# Altium schematic sheet CPU.SchDoc
size A3
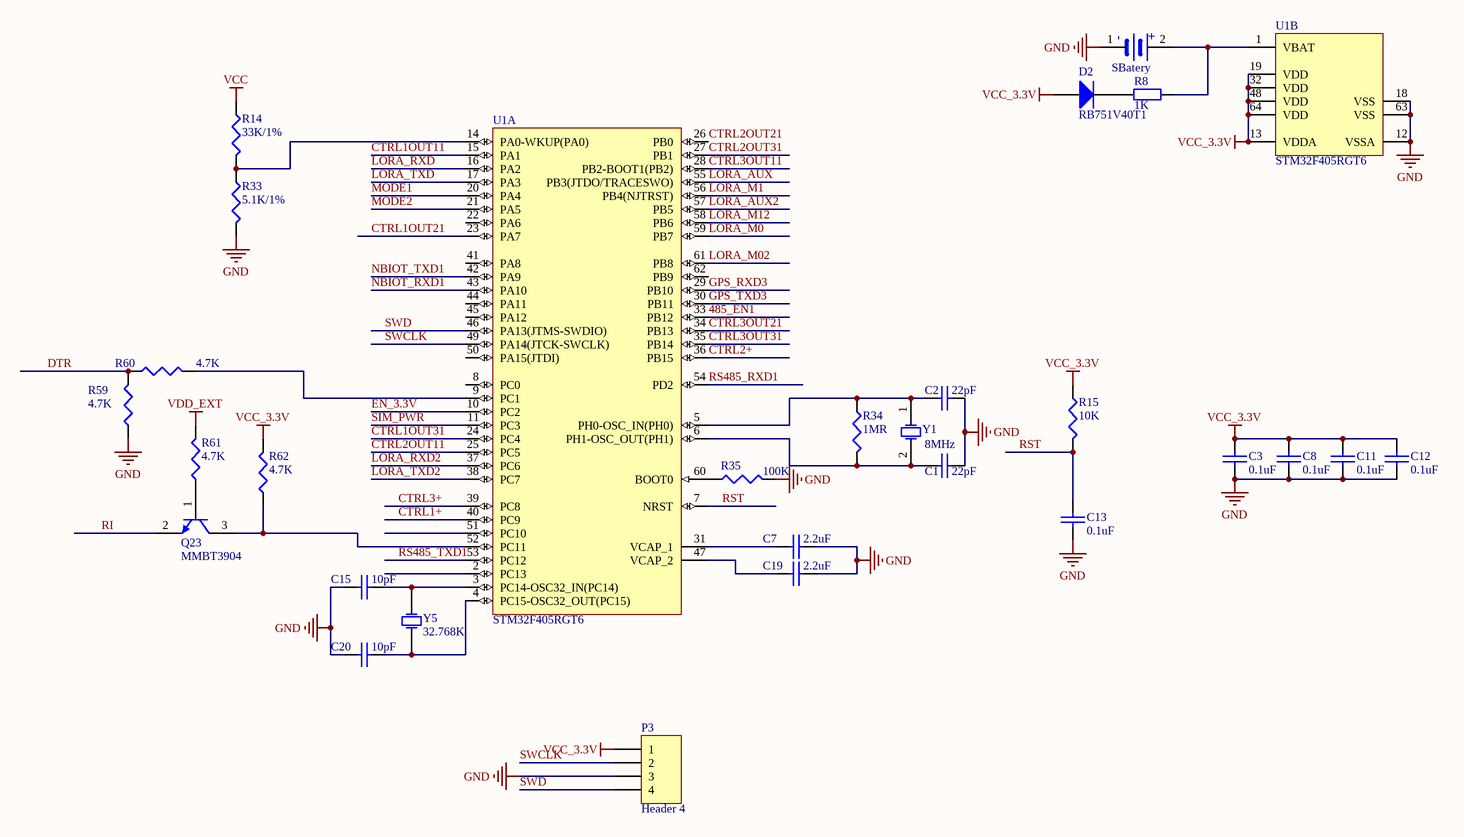
[diagram p0: CPU.SchDoc]

## Parts
C1  22pF  [0603c]
C2  22pF  [0603c]
C3  0.1uF  [0603c]
C7  2.2uF  [0603c]
C8  0.1uF  [0603c]
C11  0.1uF  [0603c]
C12  0.1uF  [0603c]
C13  0.1uF  [0603c]
C15  10pF  [0603c]
C19  2.2uF  [0603c]
C20  10pF  [0603c]
D2  RB751V40T1  [SOD323]
P3  Header 4  [HDR1X4]
Q23  MMBT3904  [SOT23-3]
R8  1K  [0603R]
R14  33K/1%  [0603R]
R15  10K  [0603R]
R33  5.1K/1%  [0603R]
R34  1MR  [0603R]
R35  100K  [0603R]
R59  4.7K  [0603R]
R60  4.7K  [0603R]
R61  4.7K  [0603R]
R62  4.7K  [0603R]
SBatery  SBatery  [MS621FE]  (value not drawn)
U1  STM32F405RGT6  [LQFP-64]  (parts A,B of 2)
Y1  8MHz  [CRAY_5032]
Y5  32.768K  [32.768K]

## Nets
GND: C1.1 C2.1 C3.1 C7.1 C8.1 C11.1 C12.1 C13.1 C15.1 C19.1 C20.1 P3.3 R33.2 R35.2 R59.1 SBatery.1 U1.12(VSSA) U1.18(VSS) U1.63(VSS)
VCC: R14.1
VCC_3.3V: C3.2 C8.2 C11.2 C12.2 D2.1(A) P3.1 R15.1 R62.2 U1.13(VDDA) U1.19(VDD) U1.32(VDD) U1.48(VDD) U1.64(VDD)
VDD_EXT: R61.2
485_EN1: U1.33(PB12)
CTRL1+: U1.40(PC9)
CTRL1OUT11: U1.15(PA1)
CTRL1OUT21: U1.23(PA7)
CTRL1OUT31: U1.24(PC4)
CTRL2+: U1.36(PB15)
CTRL2OUT11: U1.25(PC5)
CTRL2OUT21: U1.26(PB0)
CTRL2OUT31: U1.27(PB1)
CTRL3+: U1.39(PC8)
CTRL3OUT11: U1.28(PB2-BOOT1(PB2))
CTRL3OUT21: U1.34(PB13)
CTRL3OUT31: U1.35(PB14)
DTR: R59.2 R60.1
EN_3.3V: U1.10(PC2)
GPS_RXD3: U1.29(PB10)
GPS_TXD3: U1.30(PB11)
LORA_AUX: U1.55(PB3(JTDO/TRACESWO))
LORA_AUX2: U1.57(PB5)
LORA_M0: U1.59(PB7)
LORA_M1: U1.56(PB4(NJTRST))
LORA_M02: U1.61(PB8)
LORA_M12: U1.58(PB6)
LORA_RXD: U1.16(PA2)
LORA_RXD2: U1.37(PC6)
LORA_TXD: U1.17(PA3)
LORA_TXD2: U1.38(PC7)
MODE1: U1.20(PA4)
MODE2: U1.21(PA5)
NBIOT_RXD1: U1.43(PA10)
NBIOT_TXD1: U1.42(PA9)
RI: Q23.2(E)
RS485_RXD1: U1.54(PD2)
RS485_TXD1: U1.53(PC12)
RST: C13.2 R15.2 U1.7(NRST)
SIM_PWR: U1.11(PC3)
SWCLK: P3.2 U1.49(PA14(JTCK-SWCLK))
SWD: P3.4 U1.46(PA13(JTMS-SWDIO))
NetC1_2: C1.2 R34.2 U1.6(PH1-OSC_OUT(PH1)) Y1.2(OSC2)
NetC2_2: C2.2 R34.1 U1.5(PH0-OSC_IN(PH0)) Y1.1(OSC1)
NetC7_2: C7.2 U1.31(VCAP_1)
NetC15_2: C15.2 U1.3(PC14-OSC32_IN(PC14)) Y5.1(OSC1)
NetC19_2: C19.2 U1.47(VCAP_2)
NetC20_2: C20.2 U1.4(PC15-OSC32_OUT(PC15)) Y5.2(OSC2)
NetD2_2: D2.2(K) R8.1
NetQ23_1: Q23.1(B) R61.1
NetQ23_3: Q23.3(C) R62.1 U1.52(PC11)
NetR8_2: R8.2 SBatery.2 U1.1(VBAT)
NetR14_2: R14.2 R33.1 U1.14(PA0-WKUP(PA0))
NetR35_1: R35.1 U1.60(BOOT0)
NetR60_2: R60.2 U1.9(PC1)

Not connected (* = marked no-connect by the designer): U1 2(PC13) 8(PC0) 22(PA6) 41(PA8) 44(PA11) 45(PA12) 50(PA15(JTDI)) 51(PC10) 62(PB9)

## Notes on the sheet
- (in symbol SBatery) -; +

## Library data of the parts
C1-C3 C7 C8 C11-C13 C15 C19 C20 = CAP: Capacitor
D2 = Diode: Default Diode; Published: 8-Jun-2000; LatestRevisionDate: 17-Jul-2002; LatestRevisionNote: Re-released for DXP Platform.; PackageDocument: Sep-1996; PackageReference: SMC; Publisher: Altium Limited; Code_JEDEC: DO-214-AB
P3 = Header 4: Header, 4-Pin; LatestRevisionDate: 17-Jul-2002; LatestRevisionNote: Re-released for DXP Platform.; Publisher: Altium Limited
Q23 = NPN
R8 = Res2: Resistor; Published: 8-Jun-2000; LatestRevisionDate: 17-Jul-2002; LatestRevisionNote: Re-released for DXP Platform.; PackageReference: AXIAL-0.4; Publisher: Altium Limited; Value: 1K
R14 R15 R33-R35 = Res3: Resistor; Published: 8-Jun-2000; LatestRevisionDate: 29-May-2009; LatestRevisionNote: IPC-7351 Footprint Added.; PackageReference: J1-0603; Publisher: Altium Limited; PackageDescription: Chip Resistor
R59-R62 = RES1: P: 1/8W
U1 = STM32F405RGT6: ARM Cortex-M4 32-bit MCU+FPU, 210 DMIPS, 1024 kB Flash, 192 kB Internal RAM, 51 I/Os, 64-pin LQFP, -40 to 85 degC, Tray; Manufacturer: STMicroelectronics; D/A Converter: 2x12-bit; FLASH Size (Prog) (kB): 1024; I/Os (High Current): 51; Internal RAM Size (kB): 192; Operating Frequency(F) (Processor speed) (MHz): 168; Supply Voltage(Vcc) max (V): 3.6; Supply Voltage(Vcc) min (V): 1.8; DatasheetVersion: Rev. 4; PackageVersion: Rev. 4, 06/2013; PackageReference: LQFP64; PackageDescription: 64-Pin Low Profile Quad Flat Package, 10 x 10 mm Body, 0.5 mm Pitch; Supplier 1: Digi-Key; Supplier Part Number 1: 497-11767-ND; Supplier 2: Farnell; Supplier Part Number 2: 2064363; Supplier 3: Newark; Supplier Part Number 3: 73T2329; Supplier 4: Mouser; Supplier Part Number 4: 511-STM32F405RGT6; Core: ARM Cortex-M4; Packing: Tray; Mounting Technology: Surface Mount; PartNumber: STM32F405RGT6; ComponentLink1Description: Manufacturer URL; ComponentLink1URL: http://www.st.com/web/en/home.html; ComponentLink2Description: Datasheet; ComponentLink2URL: http://www.st.com/st-web-ui/static/active/en/resource/technical/document/datasheet/DM00037051.pdf; ComponentLink3Description: Package Specification; ComponentLink3URL: http://www.st.com/st-web-ui/static/active/en/resource/technical/document/datasheet/DM00037051.pdf
Y1 Y5 = XTAL: Crystal Oscillator; Published: 8-Jun-2000; LatestRevisionDate: 17-Jul-2002; LatestRevisionNote: Re-released for DXP Platform.; PackageReference: R38; Publisher: Altium Limited
  Y1: PackageDescription: Crystal, Thru-Hole; 2 Leads; Body 3.1 x 8.2 mm (Dia.xH)